# EAGLE design Blaze (EAGLE 7.4.0)
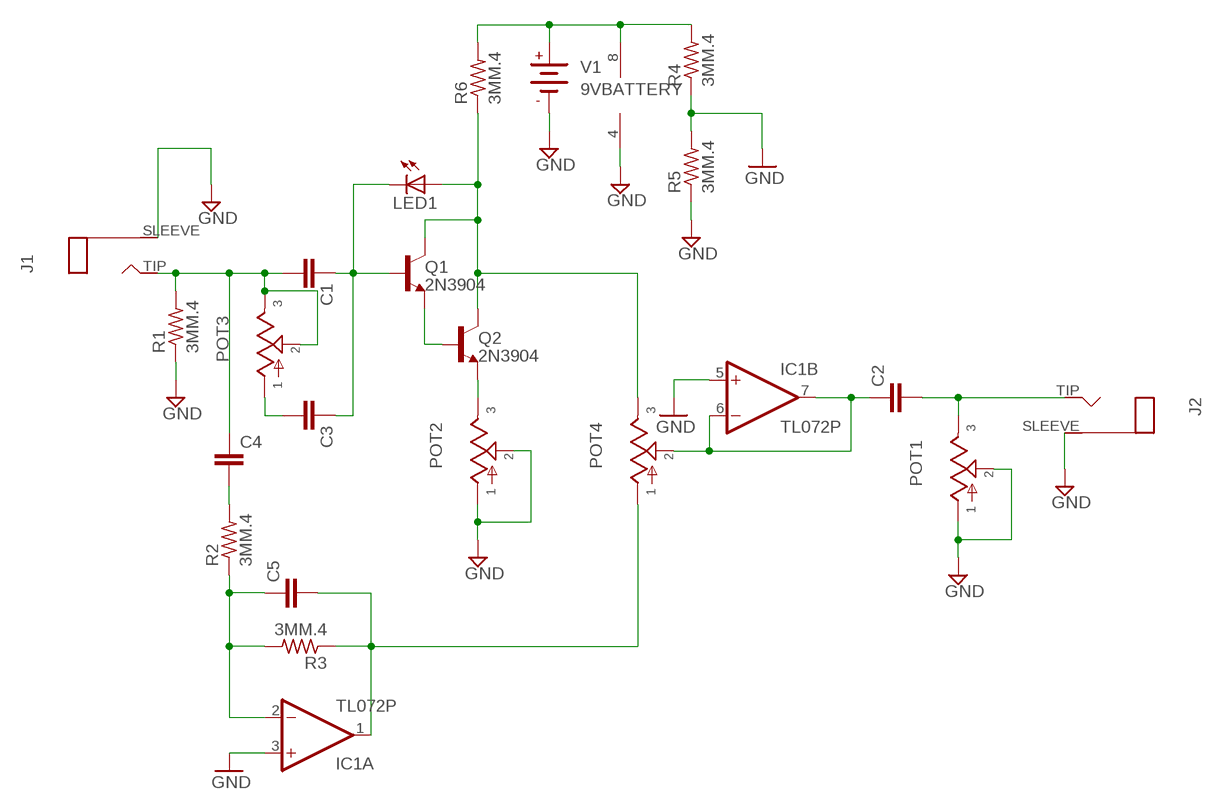
[diagram p0: schematic, sheet 1]

## Parts
C1  050X030_0251  [050X030_025]
C2  050X030_0251  [050X030_025]
C3  050X030_0251  [050X030_025]
C4  050X030_0251  [050X030_025]
C5  050X030_0251  [050X030_025]
IC1  TL072P  [DIL08]
J1  MONOA  [MONO_JACK_A]
J2  MONOA  [MONO_JACK_A]
LED1  LED5MM  [LED5MM]
POT1  POT  [POT]
POT2  POT  [POT]
POT3  POT  [POT]
POT4  POT  [POT]
Q1  2N3904  [TO92-]
Q2  2N3904  [TO92-]
R1  3MM.4  [R0204/4]
R2  3MM.4  [R0204/4]
R3  3MM.4  [R0204/4]
R4  3MM.4  [R0204/4]
R5  3MM.4  [R0204/4]
R6  3MM.4  [R0204/4]
V1  9VBATTERY  [AB9V]

## Nets
GND: IC1.3(A:+IN) IC1.4(P:V-) IC1.5(B:+IN) J1.SLEEVE J2.SLEEVE POT1.1 POT1.2 POT2.1 POT2.2 R1.1 R4.1 R5.1 R5.2 V1.-
N$1: C1.2 C4.1 J1.TIP POT3.2 POT3.3 R1.2
N$2: C1.1 C3.1 LED1.K(C) Q1.2(B)
N$3: Q1.3(E) Q2.2(B)
N$4: LED1.A POT4.3 Q1.1(C) Q2.1(C) R6.1
N$5: POT2.3 Q2.3(E)
N$6: C2.2 J2.TIP POT1.3
N$7: IC1.8(P:V+) R4.2 R6.2 V1.+
N$8: C3.2 POT3.1
N$9: C2.1 IC1.6(B:-IN) IC1.7(B:OUT) POT4.2
N$13: C5.2 IC1.1(A:OUT) POT4.1 R3.1
N$20: C4.2 R2.2
N$21: C5.1 IC1.2(A:-IN) R2.1 R3.2

## Library data of the parts
C1-C5 = gm-caps-ceramic:050X030_025: 47 - 120pF Xicon Ceramic Disc 2.5mm lead spacing
IC1 = linear:TL072: OP AMP
J1 J2 = gm-jacks:MONO: Mono 1/4" Phone Jack
LED1 = led:LED: LED OSRAM: - CHIPLED LG R971, LG N971, LY N971, LG Q971, LY Q971, LO R971, LY R971 LH N974, LH R974 LS Q976, LO Q976, LY Q976 LO Q996 - Hyper CHIPLED LW Q18S LB Q993, LB Q99A, LB R99A - SideLED LS A670, LO A670, LY A670, LG A670, LP A670 LB A673, LV A673, LT A673, LW A673 LH A674 LY A675 LS A676, LA A676, LO A676, LY A676, LW A676 LS A679, LY A679, LG A679 - Hyper Micro SIDELED® LS Y876, LA Y876, LO Y876, LY Y876 LT Y87S - SmartLED LW L88C, LW L88S LB L89C, LB L89S, LG L890 LS L89K, LO L89K, LY L89K LS L896, LA L896, LO L896, LY L896 - TOPLED LS T670, LO T670, LY T670, LG T670, LP T670 LSG T670, LSP T670, LSY T670, LOP T670, LYG T670 LG T671, LOG T671, LSG T671 LB T673, LV T673, LT T673, LW T673 LH T674 LS T676, LA T676, LO T676, LY T676, LB T676, LH T676, LSB T676, LW T676 LB T67C, LV T67C, LT T67C, LS T67K, LO T67K, LY T67K, LW E67C LS E67B, LA E67B, LO E67B, LY E67B, LB E67C, LV E67C, LT E67C LW T67C LS T679, LY T679, LG T679 LS T770, LO T770, LY T770, LG T770, LP T770 LB T773, LV T773, LT T773, LW T773 LH T774 LS E675, LA E675, LY E675, LS T675 LS T776, LA T776, LO T776, LY T776, LB T776 LHGB T686 LT T68C, LB T68C - Hyper Mini TOPLED® LB M676 - Mini TOPLED Santana® LG M470 LS M47K, LO M47K, LY M47K Source: http://www.osram.convergy.de LUXEON: - LUMILED® LXK2-PW12-R00, LXK2-PW12-S00, LXK2-PW14-U00, LXK2-PW14-V00 LXK2-PM12-R00, LXK2-PM12-S00, LXK2-PM14-U00 LXK2-PE12-Q00, LXK2-PE12-R00, LXK2-PE12-S00, LXK2-PE14-T00, LXK2-PE14-U00 LXK2-PB12-K00, LXK2-PB12-L00, LXK2-PB12-M00, LXK2-PB14-N00, LXK2-PB14-P00, LXK2-PB14-Q00 LXK2-PR12-L00, LXK2-PR12-M00, LXK2-PR14-Q00, LXK2-PR14-R00 LXK2-PD12-Q00, LXK2-PD12-R00, LXK2-PD12-S00 LXK2-PH12-R00, LXK2-PH12-S00 LXK2-PL12-P00, LXK2-PL12-Q00, LXK2-PL12-R00 Source: www.luxeon.com KINGBRIGHT: KA-3528ASYC Source: www.kingbright.com
POT1-POT4 = gm-pots:POT: Potentiometers the arrow indicates the clockwise motion of th wiper (lug 2) fully counter clockwise there is no resistance between lugs 1 and 2 fully clockwise the resistance between lugs 1 and 2 is the value of the pot
Q1 Q2 = gm-trans:2N3904: NPN Transistor
R1-R6 = gm-resistors:3MM: 3mm Resistors Leads spaced 1-6 holes apart for 0.1" perfboard. Suitable for 1/8 watt resistors.
V1 = gm-supply:9VBATTERY

## Board
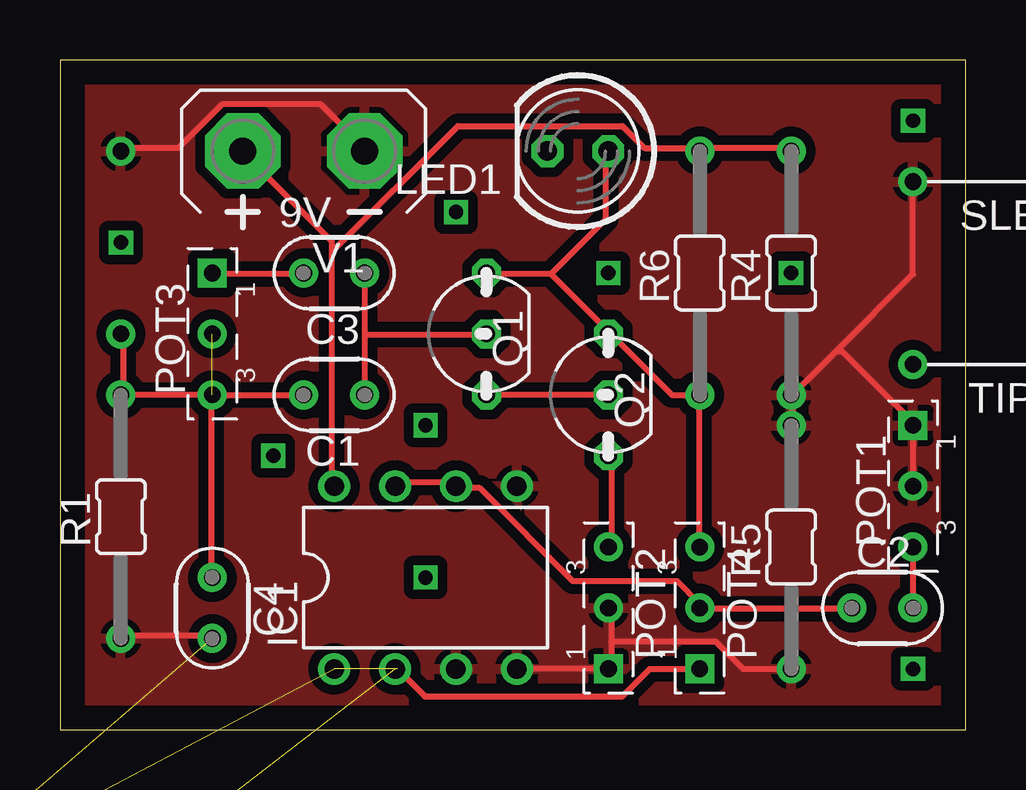
[diagram p1: board, top side]
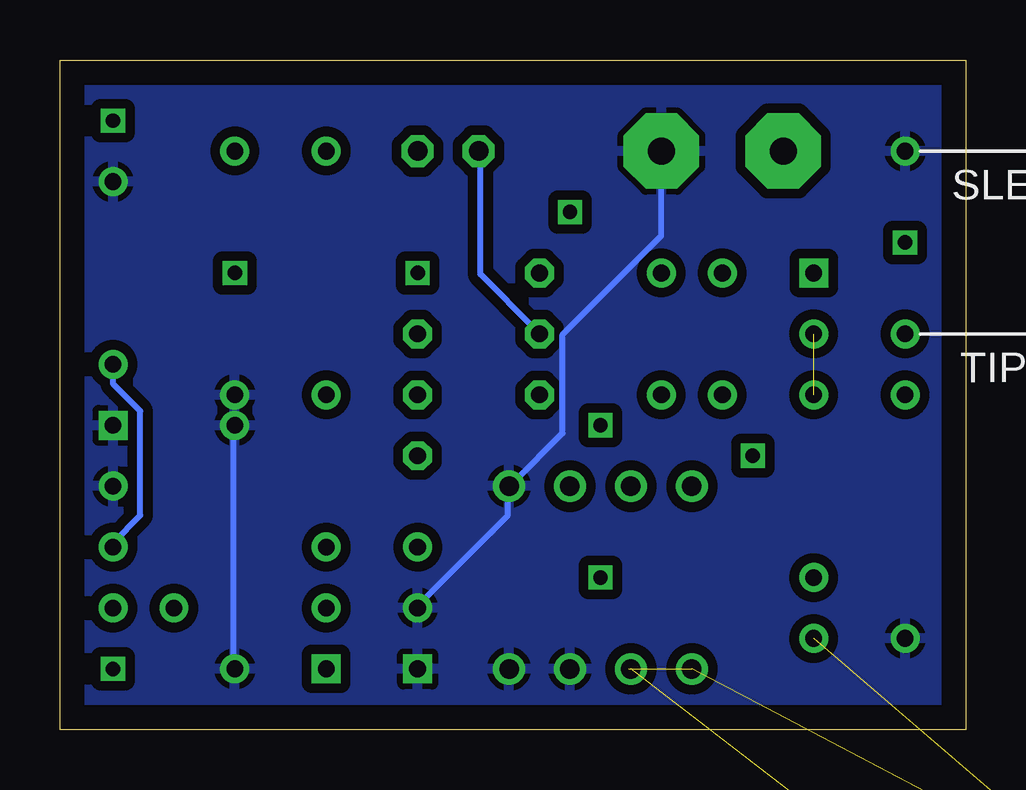
[diagram p2: board, bottom side, seen from below]

Size 37.77 x 27.93 mm. Coordinates in mm from the lower left corner, seen from the top.
Outline: 0,0 37.77,0 37.77,27.93 0,27.93 0,0
Copper layers (1*16): Top 0.035mm / dielectric 1.5mm / Bottom 0.035mm
Design rules "default": minimum track width 10mil, minimum drill 24mil, track to track 8mil, track to pad 8mil, pad to pad 8mil, via to via 8mil, smd to smd 8mil, copper to edge 40mil, drill to drill 8mil, minimum pad ring 10mil, minimum via ring 8mil, stop-mask expansion 4mil, vias tented up to drill 0mil, thermal gap 10mil

### Footprints (pad centres in the part's own frame; a part is rotated, then mirrored left to right if it is on the bottom)
050X030_025 = drill 0.7: 1 -1.27,0; 2 1.27,0
DIL08 = drill 0.813 pad 1.27: 1 -3.81,-3.81; 2 -1.27,-3.81; 3 1.27,-3.81; 4 3.81,-3.81; 5 3.81,3.81; 6 1.27,3.81; 7 -1.27,3.81; 8 -3.81,3.81
MONO_JACK_A = drill 0.7: SLEEVE 8.89,-3.81; TIP 8.89,3.81
LED5MM = drill 0.813 octagon: A -1.27,0; K 1.27,0
POT = drill 0.7 square: 1 2.54,0 | drill 0.7: 2 0,0; 3 -2.54,0
TO92- = drill 0.7 octagon: 1 2.54,0; 2 0,0; 3 -2.54,0
R0204/4 = drill 0.7: 1 -5.08,0; 2 5.08,0
AB9V = drill 1.118 pad 3.15 octagon: + 0,2.54; - 0,-2.54

### Placement (x,y rotation side)
C1  11.43,13.97 180 top
C2  34.29,5.08 0 top
C3  11.43,19.05 180 top
C4  6.35,5.08 270 top
C5  -11.43,-17.78 0 top  (outside the outline)
IC1  15.24,6.35 0 top
J1  -6.35,20.32 180 bottom
J2  44.45,19.05 180 top
LED1  21.59,24.13 180 top
POT1  35.56,10.16 90 top
POT2  22.86,5.08 270 top
POT3  6.35,16.51 90 top
POT4  26.67,5.08 270 top
Q1  17.78,16.51 90 top
Q2  22.86,13.97 90 top
R1  2.54,8.89 90 top
R2  -7.62,-3.81 0 top  (outside the outline)
R3  -7.62,-10.16 0 top  (outside the outline)
R4  30.48,19.05 90 top
R5  30.48,7.62 90 top
R6  26.67,19.05 90 top
V1  10.16,24.13 90 top

### Tracks (layer width: path | path; a pad name or v marks a point on that pad's centre or on a via)
GND
  Top 0.254: J1.SLEEVE 2.64,24.26 4.93,24.26 6.76,26.09 10.87,26.09 12.7,24.26 V1.- | POT1.2 POT1.1 35.56,12.83 32.59,15.8 32.36,15.8 | 30.53,12.83 30.53,13.97 32.36,15.8 | J2.SLEEVE 35.56,19 32.36,15.8 | 6.3,3.91 2.64,3.91 R1.1 | 22.99,3.68 22.99,5.05 POT2.2 | 22.99,3.68 22.99,2.54 POT2.1 IC1.4 | R5.1 28.47,2.54 27.33,3.68 22.99,3.68
  Bottom 0.254: POT2.2 22.76,5.28 19.1,8.94 19.1,10.08 IC1.5 18.87,10.31 16.82,12.37 16.82,16.48 12.7,20.6 V1.- | 30.53,12.6 30.53,2.54 R5.1
  pour Bottom (isolate 0.406): 0,27.94 38.1,27.94 38.1,0 0,0
  pour Top (isolate 0.406): 0,27.94 38.1,27.94 38.1,0 0,0
N$1  (1 unrouted)
  Top 0.254: 2.64,13.97 2.64,16.48 J1.TIP | 6.3,13.97 6.3,6.43 C4.1 | C1.2 POT3.3 6.3,13.97 | 6.3,13.97 2.64,13.97 | 2.64,13.97 R1.2
N$2
  Top 0.254: C3.1 12.7,16.48 | 12.7,16.48 C1.1 | 12.7,16.48 17.73,16.48 Q1.2
  Bottom 0.254: LED1.K 20.24,24.03 20.24,19 17.96,16.71 Q1.2
N$3
  Top 0.254: Q2.2 Q1.3
N$4
  Top 0.254: 26.64,13.97 26.64,7.8 POT4.3 | 20.47,19 17.96,19 Q1.1 | 20.47,19 22.76,16.71 Q2.1 22.99,16.48 25.5,13.97 26.64,13.97 | 20.47,19 22.76,21.28 22.76,24.03 LED1.A | 26.64,13.97 R6.1
N$5
  Top 0.254: POT2.3 22.99,7.8 22.99,11.23 Q2.3
N$6
  Top 0.254: POT1.3 C2.2
  Bottom 0.254: J2.TIP 35.56,14.43 34.42,13.28 34.42,8.94 35.56,7.8 POT1.3
N$7
  Top 0.254: R4.2 30.3,24.26 26.87,24.26 R6.2 26.64,24.26 24.36,24.26 23.44,25.17 16.59,25.17 11.33,19.91 | 11.33,19.91 11.33,20.37 7.67,24.03 V1.+ | 11.33,19.91 11.33,10.31 IC1.8
N$8
  Top 0.254: POT3.1 6.53,19 9.96,19 C3.2
N$9
  Top 0.254: IC1.7 14.07,10.31 16.36,10.31 IC1.6 16.59,10.08 17.5,10.08 21.39,6.2 25.73,6.2 26.64,5.28 POT4.2 26.87,5.05 32.82,5.05 C2.1
N$10  (via drill 0.6)
  other vias: 2.54,20.32
N$11  (via drill 0.6)
  other vias: 35.56,25.4
N$12  (via drill 0.6)
  other vias: 35.56,2.54
N$13  (3 unrouted)
  Top 0.254: POT4.1 24.59,2.54 23.44,1.4 15.21,1.4 14.07,2.54
N$14  (via drill 0.6)
  other vias: 8.89,11.43
N$15  (via drill 0.6)
  other vias: 16.51,21.59
N$16  (via drill 0.6)
  other vias: 15.24,12.7
N$17  (via drill 0.6)
  other vias: 22.86,19.05
N$18  (via drill 0.6)
  other vias: 15.24,6.35
N$19  (via drill 0.6)
  other vias: 30.48,19.05
N$20  (1 unrouted)
N$21  (3 unrouted)